# Altium schematic sheet Ethernet.SchDoc
size E
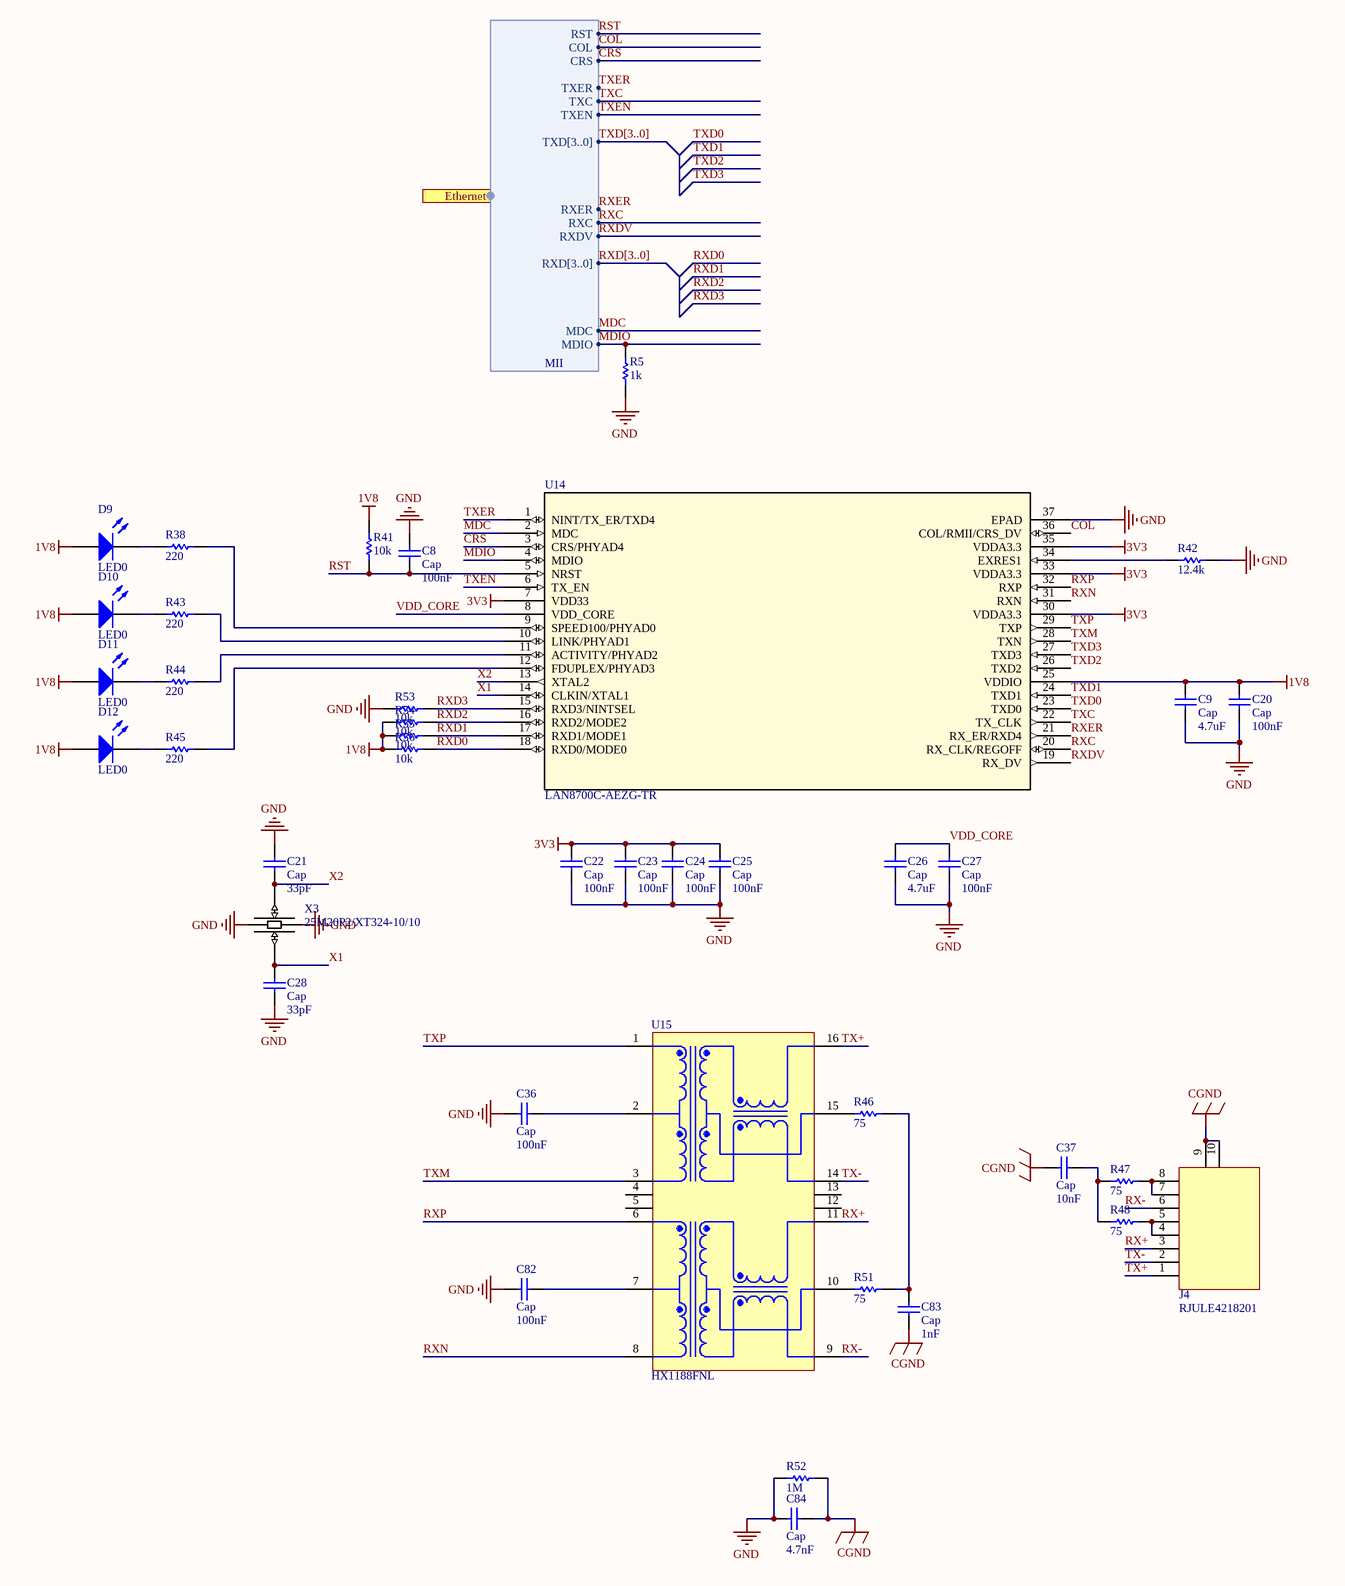
[diagram p0: Ethernet.SchDoc]

## Parts
C8  Cap  value 100nF  [0402-A]
C9  Cap  value 4.7uF  [1608[0603]]
C20  Cap  value 100nF  [6-0805_M]
C21  Cap  value 33pF  [0402-A]
C22  Cap  value 100nF  [0402-A]
C23  Cap  value 100nF  [0402-A]
C24  Cap  value 100nF  [0402-A]
C25  Cap  value 100nF  [0402-A]
C26  Cap  value 4.7uF  [1608[0603]]
C27  Cap  value 100nF  [0402-A]
C28  Cap  value 33pF  [0402-A]
C36  Cap  value 100nF  [1608[0603]]
C37  Cap  value 10nF  [0402-A]
C82  Cap  value 100nF  [1608[0603]]
C83  Cap  value 1nF  [0402-A]
C84  Cap  value 4.7nF  [C1206]
D9  LED0  [1608[0603]]
D10  LED0  [1608[0603]]
D11  LED0  [1608[0603]]
D12  LED0  [1608[0603]]
J4  RJULE4218201  [RJULE4218201]
R5  value 1k  [0402-A]  (hidden comment: Res1)
R38  value 220  [0402-A]  (hidden comment: Res1)
R41  value 10k  [0402-A]  (hidden comment: Res1)
R42  value 12.4k  [0402-A]  (hidden comment: Res1)
R43  value 220  [0402-A]  (hidden comment: Res1)
R44  value 220  [0402-A]  (hidden comment: Res1)
R45  value 220  [0402-A]  (hidden comment: Res1)
R46  value 75  [0402-A]  (hidden comment: Res1)
R47  value 75  [0402-A]  (hidden comment: Res1)
R48  value 75  [0402-A]  (hidden comment: Res1)
R51  value 75  [0402-A]  (hidden comment: Res1)
R52  value 1M  [C1206]  (hidden comment: Res1)
R53  value 10k  [0402-A]  (hidden comment: Res1)
R54  value 10k  [0402-A]  (hidden comment: Res1)
R55  value 10k  [0402-A]  (hidden comment: Res1)
R56  value 10k  [0402-A]  (hidden comment: Res1)
U14  LAN8700C-AEZG-TR  [QFN36_6X6MC_MCH]
U15  HX1188FNL  [PULS-HX1188FNL-SMT-16_V]
X3  25M20P2/XT324-10/10  [25M20P2/XT324-10/10]

## Ports
Ethernet (harness MII)

## Harnesses
MII: MDIO, MDC, RXD[3..0], TXD[3..0], RXDV, RXC, RXER, TXEN, TXC, TXER, CRS, COL, RST

## Nets
1V8: C9.1 C20.1 D9.1(A) D10.1(A) D11.1(A) D12.1(A) R41.1 R54.1 R55.1 R56.1 U14.25(VDDIO)
3V3: C22.1 C23.1 C24.1 C25.1 U14.7(VDD33) U14.30(VDDA3.3) U14.33(VDDA3.3) U14.35(VDDA3.3)
CGND: C37.2 C83.2 C84.2 J4.9 J4.10 R52.1
GND: C8.1 C9.2 C20.2 C21.2 C22.2 C23.2 C24.2 C25.2 C26.2 C27.2 C28.1 C36.2 C82.2 C84.1 R5.2 R42.1 R52.2 R53.1 U14.37(EPAD) X3.2 X3.4
COL: U14.36(COL/RMII/CRS_DV) ; port Ethernet.COL
CRS: U14.3(CRS/PHYAD4) ; port Ethernet.CRS
MDC: U14.2(MDC) ; port Ethernet.MDC
MDIO: R5.1 U14.4(MDIO) ; port Ethernet.MDIO
RST: C8.2 R41.2 U14.5(NRST) ; port Ethernet.RST
RX+: J4.3 U15.11(RX+)
RX-: J4.6 U15.9(RX-)
RXC: U14.20(RX_CLK/REGOFF) ; port Ethernet.RXC
RXD0: R56.2 U14.18(RXD0/MODE0)
RXD1: R55.2 U14.17(RXD1/MODE1)
RXD2: R54.2 U14.16(RXD2/MODE2)
RXD3: R53.2 U14.15(RXD3/NINTSEL)
RXDV: U14.19(RX_DV) ; port Ethernet.RXDV
RXER: U14.21(RX_ER/RXD4) ; port Ethernet.RXER
RXN: U14.31(RXN) U15.8(RD-)
RXP: U14.32(RXP) U15.6(RD+)
TX+: J4.1 U15.16(TX+)
TX-: J4.2 U15.14(TX-)
TXC: U14.22(TX_CLK) ; port Ethernet.TXC
TXD0: U14.23(TXD0)
TXD1: U14.24(TXD1)
TXD2: U14.26(TXD2)
TXD3: U14.27(TXD3)
TXEN: U14.6(TX_EN) ; port Ethernet.TXEN
TXER: U14.1(NINT/TX_ER/TXD4) ; port Ethernet.TXER
TXM: U14.28(TXN) U15.3(TD-)
TXP: U14.29(TXP) U15.1(TD+)
VDD_CORE: C26.1 C27.1 U14.8(VDD_CORE)
X1: C28.2 U14.14(CLKIN/XTAL1) X3.1
X2: C21.1 U14.13(XTAL2) X3.3
NetC36_1: C36.1 U15.2(TCT)
NetC37_1: C37.1 R47.2 R48.2
NetC82_1: C82.1 U15.7(RCT)
NetC83_1: C83.1 R46.1 R51.1
NetD9_2: D9.2(K) R38.1
NetD10_2: D10.2(K) R43.1
NetD11_2: D11.2(K) R44.1
NetD12_2: D12.2(K) R45.1
NetJ4_4: J4.4 J4.5 R48.1
NetJ4_7: J4.7 J4.8 R47.1
NetR38_2: R38.2 U14.9(SPEED100/PHYAD0)
NetR42_2: R42.2 U14.34(EXRES1)
NetR43_2: R43.2 U14.10(LINK/PHYAD1)
NetR44_2: R44.2 U14.11(ACTIVITY/PHYAD2)
NetR45_2: R45.2 U14.12(FDUPLEX/PHYAD3)
NetR46_2: R46.2 U15.15(CMT)
NetR51_2: R51.2 U15.10(CMT)

Not connected (* = marked no-connect by the designer): U15 4(NC) 5(NC) 12(NC) 13(NC)

## Buses and harness runs
bus RXD[3..0]
bus TXD[3..0]

## Library data of the parts
C8 C9 C20-C28 C36 C37 C82-C84 = Cap: Capacitor; Published: 8-Jun-2000; LatestRevisionDate: 17-Jul-2002; LatestRevisionNote: Re-released for DXP Platform.; PackageReference: RAD-0.3; Publisher: Altium Limited; PackageDescription: Radial Cap, Thru-Hole; 2 Leads; 0.3 in Pin Spacing
  C8 C9 C20-C28 C37 C82: Supplier 1: Digi-Key; Supplier Part Number 1: 490-3295-1-ND
R5 R38 R41-R48 R51-R56 = Res1: Resistor; Published: 8-Jun-2000; LatestRevisionDate: 17-Jul-2002; LatestRevisionNote: Re-released for DXP Platform.; PackageReference: AXIAL-0.3; Publisher: Altium Limited; PackageDescription: Axial Device, Thru-Hole; 2 Leads; 0.3 in Pin Spacing
U14 = LAN8700C-AEZG-TR: No Description Available; Mfr_Name: Microchip; Copyright: Copyright (C) 2021 Ultra Librarian. All rights reserved.; Manufacturer_Part_Number: LAN8700C-AEZG-TR; Digi-Key_Part_Number_1: LAN8700C-AEZG-CT-ND; Digi-Key_Part_Number_2: LAN8700C-AEZG-DKR-ND; Digi-Key_Part_Number_3: LAN8700C-AEZG-TR-ND; RefDes: RefDes; Type: DEV
U15 = CMP-2000-06431-1: Telecom Transformer 1:1/1:1, -40 to 85 degC, 16-Pin SMT, RoHS, Tube; Manufacturer: Pulse Electronics; Turns Ratio - Primary: Secondary:1:1Transmitter,1:1Receiver; Online Catalog: HX1188; Other Names: 553-2200; Other Related Documents: PackagesFNLvs.NL; Transformer Type: IsolationandDataInterface(Encapsulated); Datasheet Version: Rev. B, 05/2014; Family: PulseTransformers; PartNumber: HX1188FNL; Manufacturer URL: http://www.pulseelectronics.com/; Package Description: 16-Pin Surface Mount Device, Body 12.7 x 9.09 mm, Pitch 1.27 mm; Mounting Type: SurfaceMount; Package Reference: SMT; Mounting Technology: SurfaceMount; Datasheet URL: http://productfinder.pulseeng.com/products/datasheets/HX1188FNL.pdf;jsessionid=D0CB5525A348FF42F5E5BE320CB10324; Height - Seated (Max): 5.99mm; Category: Transformers; Standard Package: 40; Size / Dimension: 12.70mmLx9.00mmW
D9-D12 = LED0: Published: 8-Jun-2000; LatestRevisionDate: 08-Jul-2005; LatestRevisionNote: Mech Layer 1 removed.; PackageReference: LED-0; Publisher: Altium Limited; PackageDescription: LED; 2 Leads